# Altium schematic sheet Top Level Organization.SchDoc
size A4; SheetNumber: 2; SheetTotal: 8
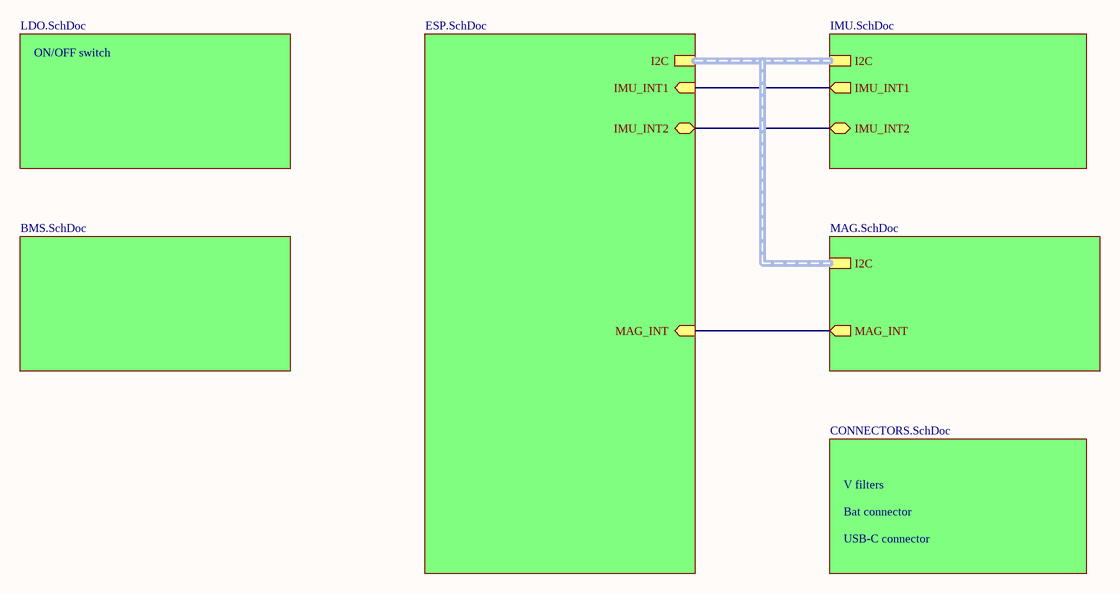
[diagram p0: Top Level Organization.SchDoc]

## Sub-sheets
Designator = ESP.SchDoc: I2C (harness SPI), MAG_INT (in), IMU_INT1 (in), IMU_INT2 (bidir)
Designator = IMU.SchDoc: I2C (harness SPI), IMU_INT1 (out), IMU_INT2 (bidir)
Designator = LDO.SchDoc: no entries
Designator = BMS.SchDoc: no entries
Designator = MAG.SchDoc: I2C (harness SPI), MAG_INT (out)
Designator = CONNECTORS.SchDoc: no entries

## Nets
(unnamed): sheet Designator/MAG_INT, sheet Designator/MAG_INT
(unnamed): sheet Designator/IMU_INT1, sheet Designator/IMU_INT1
(unnamed): sheet Designator/IMU_INT2, sheet Designator/IMU_INT2

## Notes on the sheet
- ON/OFF switch
- Bat connector
- V filters
- USB-C connector